# EAGLE design SparkFun_Artemis (EAGLE 9.4.0)
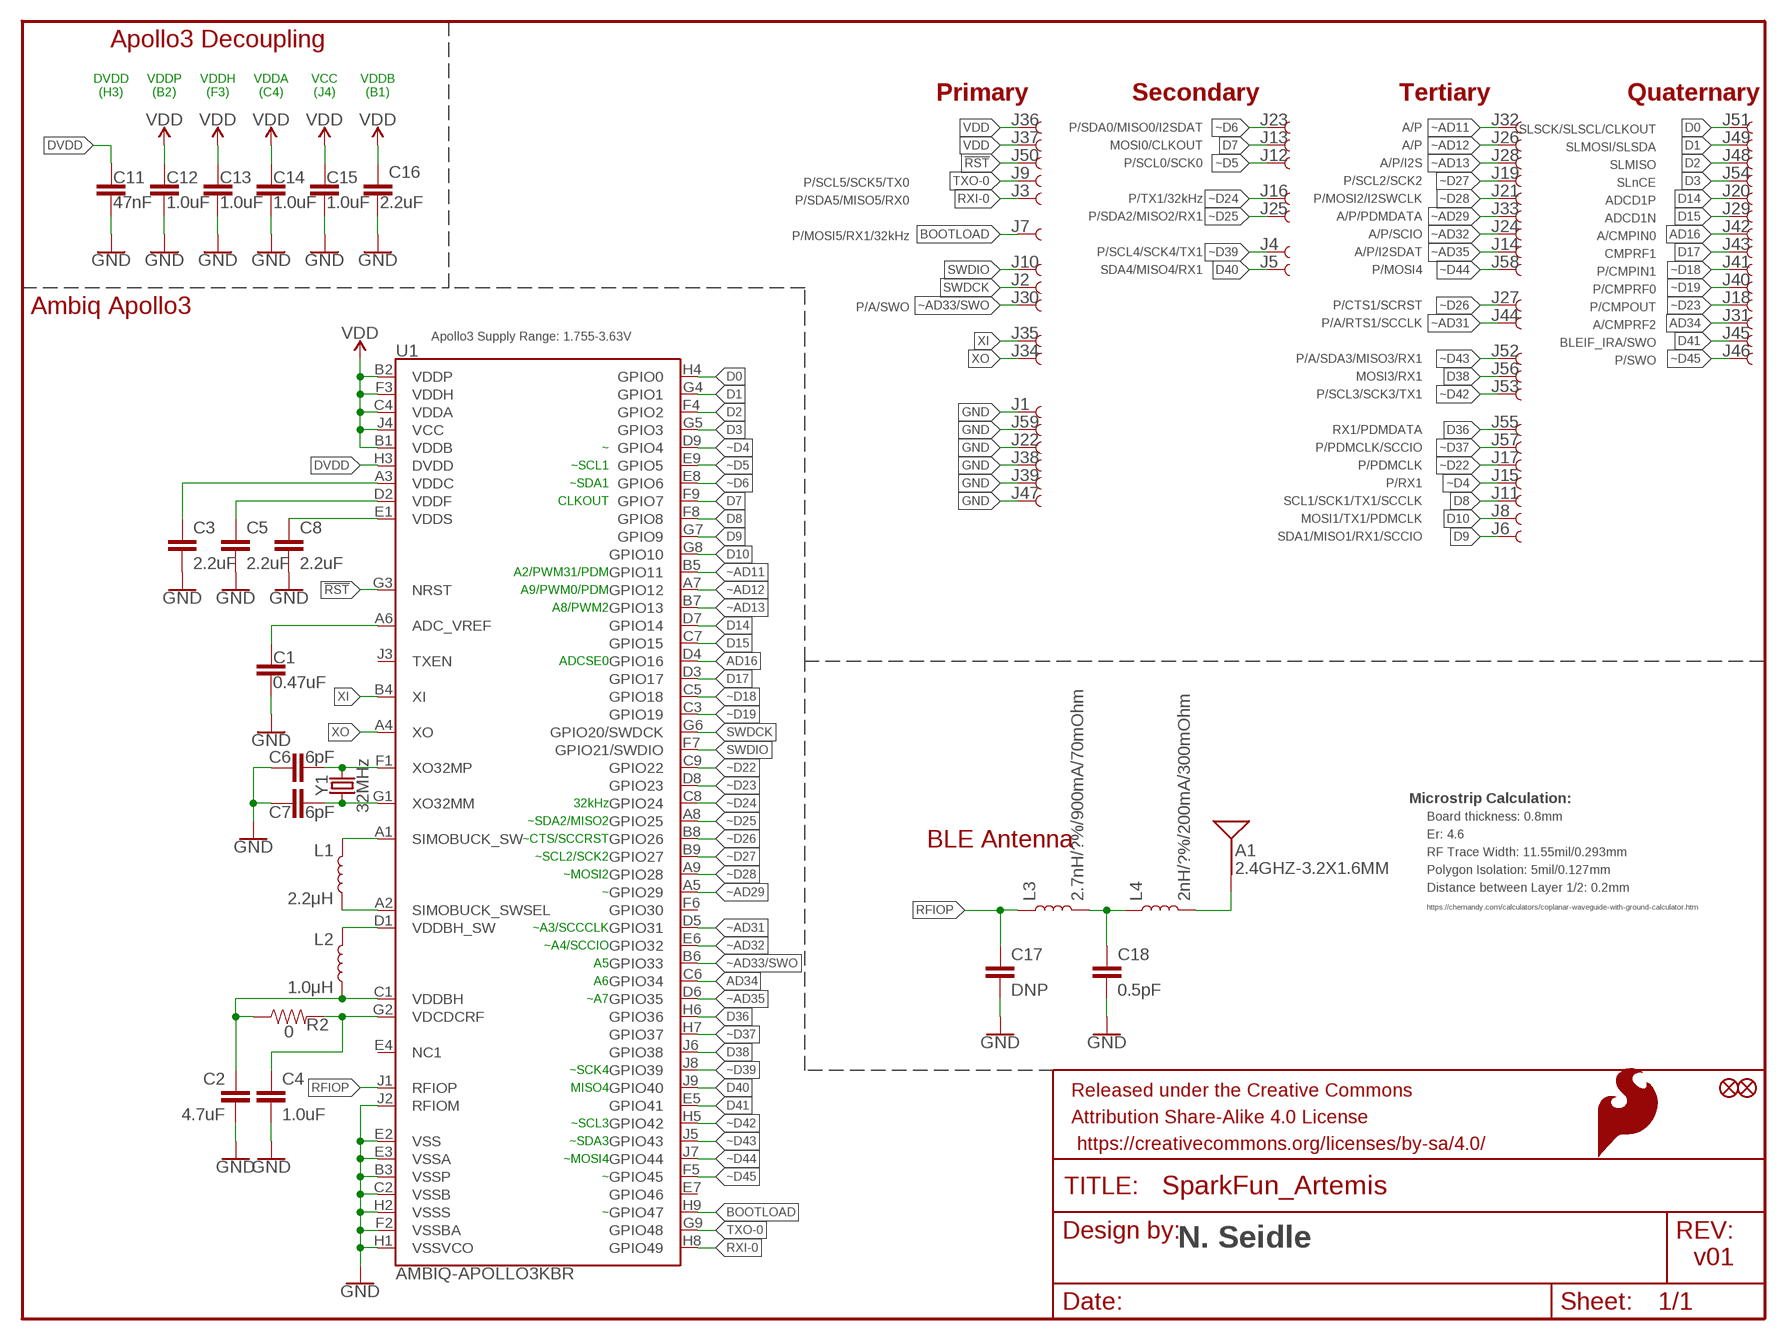
[diagram p0: schematic, sheet 1]

## Parts
A1  2.4GHZ-3.2X1.6MM  ANTENNA2.4GHZ-8.0X1.0MM  [ANT-2.4GHZ-8.0X1.0MM]
C1  0.47uF  470NF-0402_TIGHT-6.3V-10%-X5R  [0402-TIGHT]
C2  4.7uF  4.7UF-0402_TIGHT-6.3V-20%-X5R  [0402-TIGHT]
C3  2.2uF  2.2UF-0402_TIGHT-10V-10%-X5R  [0402-TIGHT]
C4  1.0uF  1.0UF-0402-TIGHT-16V-10%  [0402-TIGHT]
C5  2.2uF  2.2UF-0402_TIGHT-10V-10%-X5R  [0402-TIGHT]
C6  6pF  6PF-0402-TIGHT-50V-0.5%  [0402-TIGHT]
C7  6pF  6PF-0402-TIGHT-50V-0.5%  [0402-TIGHT]
C8  2.2uF  2.2UF-0402_TIGHT-10V-10%-X5R  [0402-TIGHT]
C11  47nF  47NF-0402_TIGHT-25V-10%-X7R  [0402-TIGHT]
C12  1.0uF  1.0UF-0402-TIGHT-16V-10%  [0402-TIGHT]
C13  1.0uF  1.0UF-0402-TIGHT-16V-10%  [0402-TIGHT]
C14  1.0uF  1.0UF-0402-TIGHT-16V-10%  [0402-TIGHT]
C15  1.0uF  1.0UF-0402-TIGHT-16V-10%  [0402-TIGHT]
C16  2.2uF  2.2UF-0402_TIGHT-10V-10%-X5R  [0402-TIGHT]
C17  DNP  DNP-CAP-0402-TIGHT  [0402-TIGHT]
C18  0.5pF  0.5PF-0402_TIGHT-20V-PM0.05PF-NP0  [0402-TIGHT]
FD3  FIDUCIAL0.2MM  [FIDUCIAL-0.2MM]
FD4  FIDUCIAL0.2MM  [FIDUCIAL-0.2MM]
FRAME1  FRAME-LETTER  [CREATIVE_COMMONS]
J1  PAD.4X.6  [MODULE_PAD]
J2  PAD.4X.6  [MODULE_PAD]
J3  PAD.4X.6  [MODULE_PAD]
J4  PAD.4X.6  [MODULE_PAD]
J5  PAD.4X.6  [MODULE_PAD]
J6  PAD.4X.6  [MODULE_PAD]
J7  PAD.4X.6  [MODULE_PAD]
J8  PAD.4X.6  [MODULE_PAD]
J9  PAD.4X.6  [MODULE_PAD]
J10  PAD.4X.6  [MODULE_PAD]
J11  PAD.4X.6  [MODULE_PAD]
J12  PAD.4X.6  [MODULE_PAD]
J13  PAD.4X.6  [MODULE_PAD]
J14  PAD.4X.6  [MODULE_PAD]
J15  PAD.4X.6  [MODULE_PAD]
J16  PAD.4X.6  [MODULE_PAD]
J17  PAD.4X.6  [MODULE_PAD]
J18  PAD.4X.6  [MODULE_PAD]
J19  PAD.4X.6  [MODULE_PAD]
J20  PAD.4X.6  [MODULE_PAD]
J21  PAD.4X.6  [MODULE_PAD]
J22  PAD.35X.35  [MODULE_MINI_PAD]
J23  PAD.4X.6  [MODULE_PAD]
J24  PAD.4X.6  [MODULE_PAD]
J25  PAD.4X.6  [MODULE_PAD]
J26  PAD.4X.6  [MODULE_PAD]
J27  PAD.4X.6  [MODULE_PAD]
J28  PAD.4X.6  [MODULE_PAD]
J29  PAD.4X.6  [MODULE_PAD]
J30  PAD.4X.6  [MODULE_PAD]
J31  PAD.4X.6  [MODULE_PAD]
J32  PAD.4X.6  [MODULE_PAD]
J33  PAD.4X.6  [MODULE_PAD]
J34  PAD.4X.6  [MODULE_PAD]
J35  PAD.4X.6  [MODULE_PAD]
J36  PAD.4X.6  [MODULE_PAD]
J37  PAD.4X.6  [MODULE_PAD]
J38  PAD.35X.35  [MODULE_MINI_PAD]
J39  PAD.4X.6  [MODULE_PAD]
J40  PAD.4X.6  [MODULE_PAD]
J41  PAD.4X.6  [MODULE_PAD]
J42  PAD.4X.6  [MODULE_PAD]
J43  PAD.4X.6  [MODULE_PAD]
J44  PAD.4X.6  [MODULE_PAD]
J45  PAD.4X.6  [MODULE_PAD]
J46  PAD.4X.6  [MODULE_PAD]
J47  PAD.4X.6  [MODULE_PAD]
J48  PAD.4X.6  [MODULE_PAD]
J49  PAD.4X.6  [MODULE_PAD]
J50  PAD.4X.6  [MODULE_PAD]
J51  PAD.4X.6  [MODULE_PAD]
J52  PAD.4X.6  [MODULE_PAD]
J53  PAD.4X.6  [MODULE_PAD]
J54  PAD.4X.6  [MODULE_PAD]
J55  PAD.4X.6  [MODULE_PAD]
J56  PAD.4X.6  [MODULE_PAD]
J57  PAD.4X.6  [MODULE_PAD]
J58  PAD.4X.6  [MODULE_PAD]
J59  PAD.4X.6  [MODULE_PAD]
L1  2.2μH  2.2μH-0805_WIDE-2.2μH-1.7A-0.14OHM  [0805-WIDE]
L2  1.0μH  1.0μH-0805_WIDE-1.0μH-1.45A-0.106OHM-1.0MM_H  [0805-WIDE]
L3  2.7nH/?%/900mA/70mOhm  INDUCTOR-0402_TIGHT-2.7NH  [0402-TIGHT]
L4  2nH/?%/200mA/300mOhm  INDUCTOR-0402_TIGHT-2.0NH  [0402-TIGHT]
LOGO1  SFE_LOGO_FLAME.05_INCH_INTERNAL  [SFE_LOGO_FLAME_INTERNAL_0.05]
R2  0  0OHM-0402T-1/10W  [0402-TIGHT]
U1  AMBIQ-APOLLO3KBR  [BGA-81-5X5MM]
Y1  32MHz  CRYSTAL-32MHZ-SMD-2.0X1.6MM  [CRYSTAL-SMD-2.0X1.6MM]

## Nets
!RST: J50.1 U1.G3(NRST)
AD16: J42.1 U1.D4(GPIO16)
AD34: J31.1 U1.C6(GPIO34)
ADC_VREF: C1.1 U1.A6(ADC_VREF)
BOOTLOAD: J7.1 U1.H9(GPIO47)
D0: J51.1 U1.H4(GPIO0)
D1: J49.1 U1.G4(GPIO1)
D2: J48.1 U1.F4(GPIO2)
D3: J54.1 U1.G5(GPIO3)
D7: J13.1 U1.F9(GPIO7)
D8: J11.1 U1.F8(GPIO8)
D9: J6.1 U1.G7(GPIO9)
D10: J8.1 U1.G8(GPIO10)
D14: J20.1 U1.D7(GPIO14)
D15: J29.1 U1.C7(GPIO15)
D17: J43.1 U1.D3(GPIO17)
D36: J55.1 U1.H6(GPIO36)
D38: J56.1 U1.J6(GPIO38)
D40: J5.1 U1.J9(GPIO40)
D41: J45.1 U1.E5(GPIO41)
DVDD: C11.1 U1.H3(DVDD)
GND: C1.2 C2.2 C3.2 C4.2 C5.2 C6.1 C7.1 C8.2 C11.2 C12.2 C13.2 C14.2 C15.2 C16.2 C17.2 C18.2 J1.1 J22.1 J38.1 J39.1 J47.1 J59.1 U1.B3(VSSP) U1.C2(VSSB) U1.E2(VSS) U1.E3(VSSA) U1.F2(VSSBA) U1.H1(VSSVCO) U1.H2(VSSS) U1.J2(RFIOM)
N$1: A1.FEED(SIGNAL) L4.2
N$2: C7.2 U1.G1(XO32MM) Y1.1
N$3: C6.2 U1.F1(XO32MP) Y1.3
N$16: C18.1 L3.2 L4.1
RFIOP: C17.1 L3.1 U1.J1(RFIOP)
RXI-0: J3.1 U1.H8(GPIO49)
SIMBUCK_SWSEL: L1.2 U1.A2(SIMOBUCK_SWSEL)
SIMOBUCK_SW: L1.1 U1.A1(SIMOBUCK_SW)
SWDCK: J2.1 U1.G6(GPIO20/SWDCK)
SWDIO: J10.1 U1.F7(GPIO21/SWDIO)
TXO-0: J9.1 U1.G9(GPIO48)
VDCDCRF: C4.1 R2.2 U1.G2(VDCDCRF)
VDD: C12.1 C13.1 C14.1 C15.1 C16.1 J36.1 J37.1 U1.B1(VDDB) U1.B2(VDDP) U1.C4(VDDA) U1.F3(VDDH) U1.J4(VCC)
VDDBH: C2.1 L2.2 R2.1 U1.C1(VDDBH)
VDDBH_SW: L2.1 U1.D1(VDDBH_SW)
VDDC: C3.1 U1.A3(VDDC)
VDDF: C5.1 U1.D2(VDDF)
VDDS: C8.1 U1.E1(VDDS)
XI: J35.1 U1.B4(XI)
XO: J34.1 U1.A4(XO)
~AD11: J32.1 U1.B5(GPIO11)
~AD12: J26.1 U1.A7(GPIO12)
~AD13: J28.1 U1.B7(GPIO13)
~AD29: J33.1 U1.A5(GPIO29)
~AD31: J44.1 U1.D5(GPIO31)
~AD32: J24.1 U1.E6(GPIO32)
~AD33/SWO: J30.1 U1.B6(GPIO33)
~AD35: J14.1 U1.D6(GPIO35)
~D4: J15.1 U1.D9(GPIO4)
~D5: J12.1 U1.E9(GPIO5)
~D6: J23.1 U1.E8(GPIO6)
~D18: J41.1 U1.C5(GPIO18)
~D19: J40.1 U1.C3(GPIO19)
~D22: J17.1 U1.C9(GPIO22)
~D23: J18.1 U1.D8(GPIO23)
~D24: J16.1 U1.C8(GPIO24)
~D25: J25.1 U1.A8(GPIO25)
~D26: J27.1 U1.B8(GPIO26)
~D27: J19.1 U1.B9(GPIO27)
~D28: J21.1 U1.A9(GPIO28)
~D37: J57.1 U1.H7(GPIO37)
~D39: J4.1 U1.J8(GPIO39)
~D42: J53.1 U1.H5(GPIO42)
~D43: J52.1 U1.J5(GPIO43)
~D44: J58.1 U1.J7(GPIO44)
~D45: J46.1 U1.F5(GPIO45)
Unconnected: U1.E4(NC1) U1.E7(GPIO46) U1.F6(GPIO30) U1.J3(TXEN)

## Notes on the sheet
- Apollo3 Decoupling
- DVDD
  (H3)
- VDDP
  (B2)
- VDDH
  (F3)
- VDDA
  (C4)
- VCC
  (J4)
- VDDB
  (B1)
- Primary | Secondary | Tertiary | Quaternary
- P/SDA0/MISO0/I2SDAT | A/P | SLSCK/SLSCL/CLKOUT
- MOSI0/CLKOUT | A/P | SLMOSI/SLSDA
- P/SCL0/SCK0 | A/P/I2S | SLMISO
- P/SCL5/SCK5/TX0 | P/SCL2/SCK2 | SLnCE
- P/SDA5/MISO5/RX0 | P/TX1/32kHz | P/MOSI2/I2SWCLK | ADCD1P
- P/SDA2/MISO2/RX1 | A/P/PDMDATA | ADCD1N
- P/MOSI5/RX1/32kHz | A/P/SCIO | A/CMPIN0
- P/SCL4/SCK4/TX1 | A/P/I2SDAT | CMPRF1
- SDA4/MISO4/RX1 | P/MOSI4 | P/CMPIN1
- P/CMPRF0
- Ambiq Apollo3 | P/A/SWO | P/CTS1/SCRST | P/CMPOUT
- P/A/RTS1/SCCLK | A/CMPRF2
- Apollo3 Supply Range: 1.755-3.63V | BLEIF_IRA/SWO
- P/A/SDA3/MISO3/RX1 | P/SWO
- MOSI3/RX1
- P/SCL3/SCK3/TX1
- RX1/PDMDATA
- ~ | P/PDMCLK/SCCIO
- ~SCL1 | P/PDMCLK
- ~SDA1 | P/RX1
- CLKOUT | SCL1/SCK1/TX1/SCCLK
- MOSI1/TX1/PDMCLK
- SDA1/MISO1/RX1/SCCIO
- A2/PWM31/PDM
- A9/PWM0/PDM
- A8/PWM2
- ADCSE0
- 32kHz | Microstrip Calculation:
- ~SDA2/MISO2 | Board thickness: 0.8mm
- ~CTS/SCCRST | BLE Antenna | Er: 4.6
- ~SCL2/SCK2 | RF Trace Width: 11.55mil/0.293mm
- ~MOSI2 | Polygon Isolation: 5mil/0.127mm
- ~ | Distance between Layer 1/2: 0.2mm
- https://chemandy.com/calculators/coplanar-waveguide-with-ground-calculator.htm
- ~A3/SCCCLK
- ~A4/SCCIO
- A5
- A6
- ~A7
- ~SCK4
- MISO4
- ~SCL3
- ~SDA3
- ~MOSI4
- ~
- ~
- N. Seidle | v01

## Library data of the parts
A1 = SparkFun-RF:ANTENNA: Single-ended Antennae 2.4GHz and antennae with just one terminal. These are all chip antennae. 2.4GHz (WiFi/BT/ZigBee) Antennae ANT-2.4GHZ-6.5X2.2MM - 6.5 x 2.2 mm chip antenna. (SparkFun Product <https://www.sparkfun.com/products/144>) ANT-2.4GHZ8.0X1.0MM - 8.0 x 1.0 mm chip antenna. (Datasheet <http://www.mouser.com/ds/2/611/antenna_2500at44m0400-242425.pdf>) ANT-2.4GHZ9.5X2.0MM - 9.5 x 2.0 mm chip antenna. (SparkFun Product <https://www.sparkfun.com/products/9025>); PROD_ID: ANT-14377
C1 = SparkFun-Capacitors:470NF: 0.47uF/470nF ceramic capacitors A capacitor is a passive two-terminal electrical component used to store electrical energy temporarily in an electric field.; PROD_ID: CAP-14242
C2 = SparkFun-Capacitors:4.7UF: 4.7µF ceramic capacitors A capacitor is a passive two-terminal electrical component used to store electrical energy temporarily in an electric field.; PROD_ID: CAP-14240
C3 C5 C8 C16 = SparkFun-Capacitors:2.2UF: 2.2µF ceramic capacitors A capacitor is a passive two-terminal electrical component used to store electrical energy temporarily in an electric field.; PROD_ID: CAP-14232
C4 C12-C15 = ambiq:1.0UF: 1µF ceramic capacitors A capacitor is a passive two-terminal electrical component used to store electrical energy temporarily in an electric field.; PROD_ID: CAP-12417
C6 C7 = ambiq:6PF: 6pF ceramic capacitors A capacitor is a passive two-terminal electrical component used to store electrical energy temporarily in an electric field.; PROD_ID: CAP-13455
C11 = SparkFun-Capacitors:47NF: 47nF ceramic capacitors A capacitor is a passive two-terminal electrical component used to store electrical energy temporarily in an electric field.; PROD_ID: CAP-14243
C17 = ambiq:DNP-CAP: 0.18µF ceramic capacitor A capacitor is a passive two-terminal electrical component used to store electrical energy temporarily in an electric field.
C18 = SparkFun-Capacitors:0.5PF: 0.5pF ceramic capacitors A capacitor is a passive two-terminal electrical component used to store electrical energy temporarily in an electric field.; PROD_ID: CAP-14231
FD3 FD4 = SparkFun-Aesthetics:FIDUCIAL: Fiducial Alignment Points Point-of-reference for pick-and-place machines and other optical instruments.
FRAME1 = SparkFun-Aesthetics:FRAME-LETTER: Schematic Frame - Letter Standard 8.5x11 US Letter frame
J1-J59 = Module-Pads:PAD
L1 = SparkFun-Coils:2.2μH: 2.2μH Inductor Resist changes in electrical current. Basically a coil of wire. SparkFun Products: SparkFun Edge - HX711 <https://www.sparkfun.com/products/15170>; PROD_ID: NDUC-14234
L2 = SparkFun-Coils:1.0μH: 1.0μH Inductor Resist changes in electrical current. Basically a coil of wire. SparkFun Products: SparkFun Edge <https://www.sparkfun.com/products/15170>; PROD_ID: NDUC-14375
L3 = SparkFun-Coils:INDUCTOR: Inductors Resist changes in electrical current. Basically a coil of wire. SparkFun Products: SparkFun Load Cell Amplifier - HX711 <https://www.sparkfun.com/products/13879> IOIO-OTG - V2.2 <https://www.sparkfun.com/products/13613>; PROD_ID: NDUC-14236
L4 = SparkFun-Coils:INDUCTOR: Inductors Resist changes in electrical current. Basically a coil of wire. SparkFun Products: SparkFun Load Cell Amplifier - HX711 <https://www.sparkfun.com/products/13879> IOIO-OTG - V2.2 <https://www.sparkfun.com/products/13613>; PROD_ID: NDUC-14238
LOGO1 = SparkFun-Aesthetics:SFE_LOGO_FLAME: SparkFun Flame Logo This is the SparkFun flame logo. The logo on the schematic will always be the same size; the package variant is the height of the flame. Default layer for the logo on the board is tSilk.
R2 = SparkFun-Resistors:0OHM: 0Ω resistor A resistor is a passive two-terminal electrical component that implements electrical resistance as a circuit element. Resistors act to reduce current flow, and, at the same time, act to lower voltage levels within circuits. - Wikipedia; PROD_ID: RES-14244
U1 = SparkFun-IC-Microcontroller:AMBIQ-APOLLO3; PROD_ID: IC-14228
Y1 = SparkFun-Clocks:CRYSTAL-32MHZ: 32MHz Crystal Digikey Example <http://www.digikey.com/product-detail/en/murata-electronics-north-america/XRCGB32M000F2P00R0/490-9769-1-ND/4952013> Frequency: 32MHz Frequency Stability: ±20ppm Frequency Tolerance: ±20ppm Load Capacitance: 6pF SparkFun Products SparkFun nRF52832 Breakout <https://www.sparkfun.com/products/13990>; PROD_ID: XTAL-13459

## Net classes
1 power: width 0.178 mm
2 3.3V: width 0.508 mm

## Board
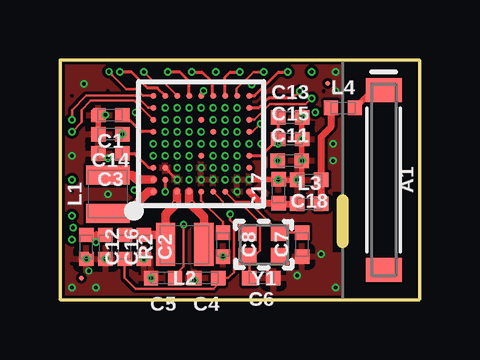
[diagram p1: board, top side]
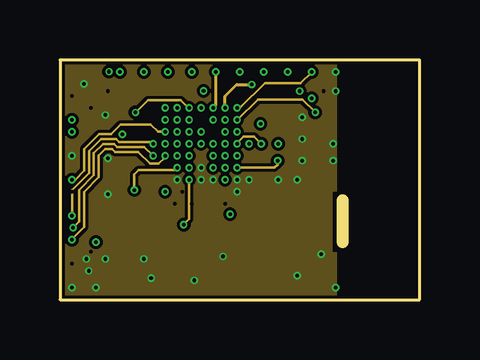
[diagram p2: board, inner layer GND]
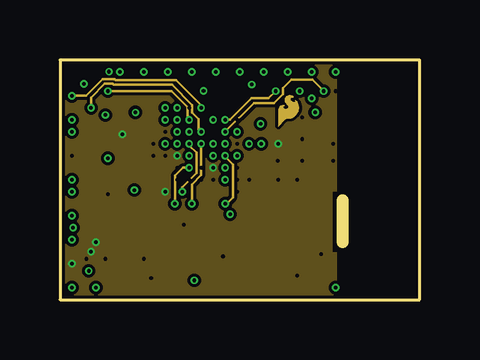
[diagram p3: board, inner layer VDD]
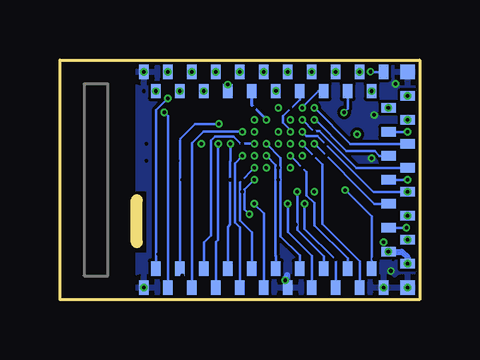
[diagram p4: board, bottom side, seen from below]

Size 15 x 10 mm. Coordinates in mm from the lower left corner, seen from the top.
Outline: 0,0 15,0 15,10 0,10 0,0
Copper layers ((1*2)+(15*16)): Top 0.035mm / dielectric 0.213359375mm / GND 0.035mm / dielectric 1.0161mm / VDD 0.035mm / dielectric 0.213359375mm / Bottom 0.035mm
Design rules "SparkFun-4-layer-BGA-Extreme *": minimum track width 4mil, minimum drill 0.15mm, track to track 4mil, track to pad 4mil, pad to pad 4mil, via to via 4mil, smd to smd 0mil, copper to edge 5mil, drill to drill 4mil, minimum pad ring 3mil, minimum via ring 3mil, stop-mask expansion 4mil, vias tented up to drill 25mil, thermal gap 10mil
Milling: 1 lines

### Footprints (pad centres in the part's own frame; a part is rotated, then mirrored left to right if it is on the bottom)
ANT-2.4GHZ-8.0X1.0MM = smd 1 x 1.5: FEED -3.75,0; NC 3.75,0
0402-TIGHT = smd 0.6 x 0.6: 1 -0.5,0; 2 0.5,0
FIDUCIAL-0.2MM = smd 0.2 x 0.2: 1 0,0
MODULE_PAD = smd 0.6 x 0.4: 1 0,0
MODULE_MINI_PAD = smd 0.6 x 0.6: 1 0,0
0805-WIDE = smd 0.8 x 1.8: 1 -0.8,0; 2 0.8,0
BGA-81-5X5MM = smd 0.254 x 0.254: A1 -2,2; A2 -1.5,2; A3 -1,2; A4 -0.5,2; A5 0,2; A6 0.5,2; A7 1,2; A8 1.5,2; A9 2,2; B1 -2,1.5; B2 -1.5,1.5; B3 -1,1.5; B4 -0.5,1.5; B5 0,1.5; B6 0.5,1.5; B7 1,1.5; B8 1.5,1.5; B9 2,1.5; C1 -2,1; C2 -1.5,1; C3 -1,1; C4 -0.5,1; C5 0,1; C6 0.5,1; C7 1,1; C8 1.5,1; C9 2,1; D1 -2,0.5; D2 -1.5,0.5; D3 -1,0.5; D4 -0.5,0.5; D5 0,0.5; D6 0.5,0.5; D7 1,0.5; D8 1.5,0.5; D9 2,0.5; E1 -2,0; E2 -1.5,0; E3 -1,0; E4 -0.5,0; E5 0,0; E6 0.5,0; E7 1,0; E8 1.5,0; E9 2,0; F1 -2,-0.5; F2 -1.5,-0.5; F3 -1,-0.5; F4 -0.5,-0.5; F5 0,-0.5; F6 0.5,-0.5; F7 1,-0.5; F8 1.5,-0.5; F9 2,-0.5; G1 -2,-1; G2 -1.5,-1; G3 -1,-1; G4 -0.5,-1; G5 0,-1; G6 0.5,-1; G7 1,-1; G8 1.5,-1; G9 2,-1; H1 -2,-1.5; H2 -1.5,-1.5; H3 -1,-1.5; H4 -0.5,-1.5; H5 0,-1.5; H6 0.5,-1.5; H7 1,-1.5; H8 1.5,-1.5; H9 2,-1.5; J1 -2,-2; J2 -1.5,-2; J3 -1,-2; J4 -0.5,-2; J5 0,-2; J6 0.5,-2; J7 1,-2; J8 1.5,-2; J9 2,-2
CRYSTAL-SMD-2.0X1.6MM = smd 0.75 x 0.7: 1 -0.675,-0.5; 2 0.675,-0.5; 3 0.675,0.5; 4 -0.675,0.5

### Placement (x,y rotation side)
A1  13.5,5 270 top
C1  2.1,7.7 180 top
C2  3.5,2.2 270 top
C3  2.1,6.1 180 top
C4  6.1,0.9 180 top
C5  4.3,0.9 180 top
C6  8.4,0.9 180 top
C7  10.1,2.3 90 top
C8  6.8,2.3 270 top
C11  9.59,5.8 0 top
C12  1.1,2.2 270 top
C13  9.6,7.6 0 top
C14  2.1,6.9 180 top
C15  9.6,6.7 0 top
C16  1.9,2.2 270 top
C17  9.12,4.52 90 top
C18  10.4,5 180 top
FD3  0.89,0.89 0 top
FD4  11.18,9.02 0 top
FRAME1  1,-13 0 top  (outside the outline)
J1  11.5,9.5 270 bottom
J2  11,8.7 270 bottom
J3  10.5,9.5 90 bottom
J4  10,8.7 270 bottom
J5  9.5,9.5 270 bottom
J6  9,8.7 270 bottom
J7  8.5,9.5 270 bottom
J8  8,8.7 270 bottom
J9  7.5,9.5 90 bottom
J10  7,8.7 90 bottom
J11  6.5,9.5 270 bottom
J12  6,8.7 270 bottom
J13  5.5,9.5 270 bottom
J14  5,8.7 90 bottom
J15  4.5,9.5 270 bottom
J16  4,8.7 90 bottom
J17  3.5,9.5 270 bottom
J18  3,8.7 90 bottom
J19  2.5,9.5 90 bottom
J20  2,8.7 90 bottom
J21  1.5,9.5 90 bottom
J22  0.5,9.5 90 bottom
J23  0.5,8.5 180 bottom
J24  1.3,8 0 bottom
J25  0.5,7.5 0 bottom
J26  1.3,7 180 bottom
J27  0.5,6.5 0 bottom
J28  1.3,6 180 bottom
J29  0.5,5.5 0 bottom
J30  1.3,5 180 bottom
J31  0.5,4.5 180 bottom
J32  1.3,4 0 bottom
J33  0.5,3.5 180 bottom
J34  1.3,3 0 bottom
J35  0.5,2.5 0 bottom
J36  1.3,2 180 bottom
J37  0.5,1.5 0 bottom
J38  0.5,0.5 0 bottom
J39  1.5,0.5 90 bottom
J40  2,1.3 270 bottom
J41  2.5,0.5 270 bottom
J42  3,1.3 270 bottom
J43  3.5,0.5 270 bottom
J44  4,1.3 90 bottom
J45  4.5,0.5 270 bottom
J46  5,1.3 270 bottom
J47  5.5,0.5 270 bottom
J48  6,1.3 270 bottom
J49  6.5,0.5 270 bottom
J50  7,1.3 90 bottom
J51  7.5,0.5 270 bottom
J52  8,1.3 90 bottom
J53  8.5,0.5 90 bottom
J54  9,1.3 270 bottom
J55  9.5,0.5 90 bottom
J56  10,1.3 270 bottom
J57  10.5,0.5 270 bottom
J58  11,1.3 270 bottom
J59  11.5,0.5 270 bottom
L1  2,4.4 90 top
L2  5.2,2.3 180 top
L3  10.4,4 0 top
L4  11.8,8 0 top
LOGO1  9.53,7.87 0 top
R2  2.7,2.2 270 top
U1  5.89,6.5 90 top
Y1  8.5,2.3 180 top

### Tracks (layer width: path | path; a pad name or v marks a point on that pad's centre or on a via)
!RST  (via drill 0.15)
  Bottom 0.102: J50.1 7,2.8 7.5,3.3 7.5,4.89 U1.G3
  other vias: 6.89,5.5
AD16  (via drill 0.15)
  Bottom 0.102: U1.D4 4.72,5.33 4.72,4.35 4.39,4.03 4.39,3.1 3,1.71 J42.1
  other vias: 5.39,6
AD34  (via drill 0.15, 0.15 layers 15-16)
  Bottom 0.102: U1.C6 4.72,6.83 4.25,6.83 1.92,4.5 J31.1
  other vias: 4.89,7 0.5,4.5
ADC_VREF
  Top 0.127: U1.A6 3.39,7 2.69,7.7 C1.1
BOOTLOAD  (via drill 0.15)
  Top 0.102: U1.H9 7.37,8.52 7.37,8.81 8.06,9.5 J7.1
  other vias: 8.5,9.5
D0  (via drill 0.15)
  Bottom 0.102: J51.1 7.5,3.01 7.7,3.22 7.7,5.69 U1.H4
  other vias: 7.39,6
D1  (via drill 0.15, 0.15 layers 15-16)
  VDD 0.102: U1.G4 6.89,5.97 7.22,5.64 7.22,4.26 6.95,4 v6.9,4
  Bottom 0.102: J49.1 6.5,3.6 v6.9,4
  other vias: 6.89,6
D2  (via drill 0.15)
  Bottom 0.102: J48.1 6,1.81 6.01,1.82 6.01,5.62 U1.F4
  other vias: 6.39,6
D3  (via drill 0.15)
  Bottom 0.102: J54.1 9,2.39 8.7,2.69 8.7,6.63 8.53,6.8 7.76,6.8 7.46,6.5 U1.G5
  other vias: 6.89,6.5
D7  (via drill 0.15)
  Top 0.127: U1.F9 6.36,8.53 6.36,9.06 5.92,9.5 J13.1
  other vias: 5.5,9.5
D8  (via drill 0.15, 0.15 layers 1-2)
  GND 0.127: U1.F8 6.5,8.11 J11.1
  other vias: 6.39,8 6.5,9.5
D9  (via drill 0.15, 0.15 layers 15-16)
  Top 0.102: U1.G7
  VDD 0.102: J6.1 8.7,8.4 8,8.4 7.1,7.5 U1.G7
  other vias: 6.89,7.5 9,8.7
D10  (via drill 0.15, 0.15 layers 1-2)
  GND 0.127: U1.G8 6.89,8.49 7.37,8.97 v8,8.97
  Bottom 0.127: v8,8.97 J8.1
  other vias: 6.89,8
D14  (via drill 0.15, 0.15 layers 15-16)
  VDD 0.102: U1.D7 5.32,7.57 5.32,8.04 4.65,8.7 J20.1
  other vias: 5.39,7.5 2,8.7
D15  (via drill 0.15)
  Bottom 0.102: U1.C7 4.42,7.03 4.17,7.03 2.63,5.5 J29.1
  other vias: 4.89,7.5
D17  (via drill 0.15, 0.15 layers 15-16)
  VDD 0.102: U1.D3 5.13,5.5 4.79,5.17 v4.79,4
  Bottom 0.102: v4.79,4 4.79,2.95 3.5,1.66 J43.1
  other vias: 5.39,5.5
D36  (via drill 0.15)
  Bottom 0.102: U1.H6 7.4,7.01 9.02,7.01 9.5,6.53 J55.1
  other vias: 7.39,7
D38  (via drill 0.15)
  Top 0.102: U1.J6 8.04,7 v8.37,7.33
  Bottom 0.102: J56.1 10,6.7 9.37,7.33 v8.37,7.33
D40  (via drill 0.15)
  Top 0.127: J5.1 9.12,9.5 8.12,8.5 U1.J9
  other vias: 9.5,9.5
D41  (via drill 0.15, 0.15 layers 15-16)
  VDD 0.102: U1.E5 5.89,6.22 5.89,6.21 5.89,5.2 5.5,4.8 v5.5,4
  Bottom 0.102: v5.5,4 5.5,2.82 4.5,1.82 J45.1
  other vias: 5.89,6.5
DVDD  (via drill 0.15 layers 1-2)
  Top 0.127: C11.1 9.09,5.99
  GND 0.102: U1.H3 8.95,5.5 9.09,5.64 C11.1
  GND 0.127: C11.1
  other vias: 7.39,5.5 9.09,5.8
GND  (via drill 0.15, 0.15 layers 1-2)
  Top 0.127: U1.B3 4.52,5.37 4.52,5.35 4.74,5.13 4.75,5.13 U1.C2
  Top 0.2: C1.2 C14.2 | U1.J2 v9.1,5 C17.2 9.14,5 C18.2 10.09,5.19 C11.2 10.09,6.69 C15.2 C13.2
  Bottom 0.254: J47.1 5.5,0.7 v5.6,0.8 5.6,0.88 5.53,0.95 5.53,1.03
  other vias: 4.89,5 6.39,5 5.89,5 7.39,5 7.89,5 7.39,4.5 5.89,5.5 3.5,1.7 1.9,1.7 1.1,1.7 6.8,1.8 10.1,7.6 9.9,5 11.5,8.7 11.4,6.5 11.4,5.8 11.5,9.5 10.9,1.9 9.9,1 1.5,0.5 11.5,0.5 10.1,6.7 10.1,5.8 1,9 2,5.9 0.5,6 1.9,7.7 0.5,0.5 1.2,1.2 2,4.4 3.8,0.9
  pour GND (isolate 0.127, rank 6): 0,10 0,0 11.5,0 11.5,10
  pour Bottom (isolate 0.127): 0,10 0,0 11.8,0 11.8,10
  pour Top (isolate 0.127): 11.81,10 11.81,0 0,0 0,10
N$1
  Top 0.254: A1.FEED 13.05,8.75 L4.2
N$2
  Top 0.102: U1.G1 7.32,4.07 7.89,4.07 9.17,2.8 Y1.1 | 9.12,2.74 9.24,2.74 Y1.1 | Y1.1 C7.2
  Top 0.127: 9.38,2.6 9.24,2.74
N$3
  Top 0.102: U1.F1 7.02,3.87 7.7,3.87 8.35,3.21 8.35,2.05 8.1,1.8 Y1.3 | Y1.3 | Y1.3 7.9,1.73 C6.2 | Y1.3 | Y1.3 7.83,1.86
  Top 0.127: U1.F1
N$4
  cutout GND (isolate 0.305): 11.4,4.5 12.1,4.5 12.1,2 11.4,2
  cutout VDD (isolate 0.305): 11.4,4.5 12.1,4.5 12.1,2 11.4,2
  cutout Top (isolate 0.305): 11.4,4.5 12.1,4.5 12.1,2 11.4,2
  cutout Bottom (isolate 0.305): 11.4,4.5 12.1,4.5 12.1,2 11.4,2
N$16
  Top 0.293: L3.2 C18.1 10.9,6.8 11.3,7.2 L4.1
RFIOP
  Top 0.293: U1.J1 8.37,4.02 C17.1 | 9.14,4 L3.1
  Top 0.305: C17.1 9.14,4
RXI-0  (via drill 0.15, 0.15 layers 1-2)
  GND 0.102: J3.1 10.03,9.03 8.55,9.03 7.52,8 U1.H8
  other vias: 7.39,8 10.5,9.5
SIMBUCK_SWSEL
  Top 0.356: 2.54,5 2.34,5.2 L1.2 3,5.2 3.2,5 U1.A2
SIMOBUCK_SW
  Top 0.356: L1.1 2.81,3.6 3.71,4.5 U1.A1
SWDCK  (via drill 0.15, 0.15 layers 15-16)
  VDD 0.102: J2.1 10.53,9.17 9.65,9.17 9.3,8.83 9.3,8.57 8.93,8.2 8.08,8.2 U1.G6
  other vias: 6.89,7 11,8.7
SWDIO  (via drill 0.15)
  Bottom 0.127: U1.F7 7,8.11 J10.1
  other vias: 6.39,7.5
TXO-0  (via drill 0.15)
  Top 0.127: U1.G9 6.89,9.29 7.1,9.5 J9.1
  other vias: 7.5,9.5
VDCDCRF  (via drill 0.15)
  Top 0.102: v7.1,3.57 7.1,3.32 7.25,3.16 7.25,1.14 7.02,0.9 C4.1 6.6,0.65 6.4,0.45 3.15,0.45 2.7,0.9 R2.2
  Bottom 0.102: v7.1,3.57 7.3,3.77 7.3,4.59 U1.G2
  other vias: 6.89,5
VDD  (via drill 0.15, 0.15 layers 15-16)
  Top 0.102: C15.1 v9.1,6.5
  Top 0.127: U1.B2 U1.B1 | U1.J4 8.4,6 C15.1 C13.1 | C16.1 1.7,2.5
  Top 0.2: C16.1 2,2.6
  Top 0.254: v1.5,2.4 1.5,2.67 1.52,2.7
  Top 0.3: C12.1 1.52,2.7 C16.1
  Bottom 0.254: J36.1 0.75,2 0.5,1.75 J37.1
  other vias: 4.39,4.5 6.39,5.5 4.89,6 2.6,6.9 0.5,1.5 1.3,2
  pour VDD (isolate 0.127): 0,10 0,0 11.5,0 11.5,10
VDDBH
  Top 0.356: U1.C1 4.89,4.03 4.4,3.55 4.4,2.67 | 4.4,2.19 L2.2 4.4,2.67 | 4.4,2.67 4.37,2.7 C2.1 R2.1
VDDBH_SW
  Top 0.356: U1.D1 5.39,4.06 6,3.45 L2.1
VDDC
  Top 0.127: U1.A3 3.7,5.5 3.1,6.1 C3.1
VDDF  (via drill 0.15 layers 1-2)
  Top 0.102: C5.1 4.8,1.02 5.16,1.38 v5.16,3.13
  GND 0.102: U1.D2 5.39,3.36 v5.16,3.13
  other vias: 5.39,5
VDDS
  Top 0.102: U1.E1 5.89,4.14 6.8,3.23 C8.1
XI  (via drill 0.15, 0.15 layers 1-2)
  GND 0.102: U1.B4 4.39,5.94 4.12,5.67 3.75,5.67 3.26,6.17 2.3,6.17 2.18,6.28 1.88,6.28 1.62,6.02 1.62,5.11 1,4.5 1,3.71 1.01,3.71 1.01,3.03 0.5,2.52 J35.1
  other vias: 4.39,6 0.5,2.5
XO  (via drill 0.15, 0.15 layers 1-2)
  GND 0.102: v0.55,3 0.8,3.26 0.8,3.63 0.8,4.58 1.41,5.2 1.41,6.11 1.8,6.5 2.25,6.5 2.38,6.37 3.52,6.37 U1.A4
  Bottom 0.102: J34.1 v0.55,3
  other vias: 3.89,6
~AD11  (via drill 0.15)
  Bottom 0.102: U1.B5 1.89,4 J32.1
  other vias: 4.39,6.5
~AD12  (via drill 0.15)
  Top 0.102: U1.A7 3.09,8.3 1.28,8.3 0.9,7.92 0.9,7.4 v0.5,7
  Bottom 0.102: v0.5,7 J26.1
~AD13  (via drill 0.15)
  Bottom 0.102: U1.B7 4.35,7.5 3.05,6.2 1.87,6.2 1.67,6 J28.1
  other vias: 4.39,7.5
~AD29  (via drill 0.15, 0.15 layers 1-2)
  GND 0.102: J33.1 0.5,4.57 1.21,5.28 1.21,6.2 1.71,6.7 2.33,6.7 2.46,6.57 3.82,6.57 U1.A5
  other vias: 3.89,6.5 0.5,3.5
~AD31  (via drill 0.15, 0.15 layers 15-16)
  VDD 0.102: v5.1,4.5 5.1,4.69 5.69,5.28 5.69,6.13 5.39,6.43 U1.D5
  Bottom 0.102: v5.1,4.5 5.1,2.9 4,1.8 J44.1
  other vias: 5.39,6.5
~AD32  (via drill 0.15, 0.15 layers 15-16)
  VDD 0.102: U1.E6 5.79,7.1 5.79,7.53 5.52,7.8 5.52,8.12 4.68,8.96 2.24,8.96 2.2,9 1.87,9 1.3,8.43 J24.1
  other vias: 5.89,7 1.3,8
~AD33/SWO  (via drill 0.15, 0.15 layers 1-2)
  GND 0.102: v0.5,5 0.63,5 1.01,5.38 1.01,6.28 1.63,6.9 2.14,6.9 2.53,7.3 3.79,7.3 4.09,7 U1.B6
  Bottom 0.102: v0.5,5 J30.1
  other vias: 4.39,7
~AD35  (via drill 0.15)
  Bottom 0.102: U1.D6 5.39,7.07 5.69,7.38 5.69,7.66 5,8.35 J14.1
  other vias: 5.39,7
~D4  (via drill 0.15)
  Top 0.127: U1.D9 5.39,9.11 5,9.5 J15.1
  other vias: 4.5,9.5
~D5  (via drill 0.15)
  Top 0.127: U1.E9 5.89,8.61 v5.99,8.71
  Bottom 0.127: J12.1 v5.99,8.71
~D6  (via drill 0.15, 0.15 layers 15-16)
  VDD 0.102: J23.1 1.09,8.51 1.79,9.21 2.28,9.21 2.32,9.16 4.83,9.16 5.89,8.11 U1.E8
  other vias: 0.5,8.5 5.89,8
~D18  (via drill 0.15)
  Bottom 0.102: U1.C5 4.89,6.47 4.06,5.64 4.06,3.16 2.5,1.6 J41.1
  other vias: 4.89,6.5
~D19  (via drill 0.15, 0.15 layers 1-2)
  Top 0.127: U1.C3
  GND 0.102: U1.C3 4.79,5.4 3.29,5.4 3.1,5.21 v3.1,4.57
  Bottom 0.102: J40.1 2,3.47 v3.1,4.57
  other vias: 4.89,5.5
~D22  (via drill 0.15)
  Top 0.102: U1.C9 4.26,9.13 3.87,9.13 J17.1
  other vias: 3.5,9.5
~D23  (via drill 0.15, 0.15 layers 1-2)
  GND 0.102: U1.D8 5.35,8 5.02,8.33 3.68,8.33 v3.15,7.81
  Bottom 0.102: v3.15,7.81 3,7.96 J18.1
  other vias: 5.39,8
~D24  (via drill 0.15)
  Bottom 0.102: U1.C8 4.89,8.03 4.22,8.7 J16.1
  other vias: 4.89,8
~D25  (via drill 0.15)
  Top 0.102: U1.A8 3.67,8 3.17,8.5 1.1,8.5 0.5,7.9 J25.1
  other vias: 0.5,7.5
~D26  (via drill 0.15)
  Bottom 0.102: J27.1 2.89,6.5 U1.B8
  other vias: 4.39,8
~D27  (via drill 0.15)
  Top 0.127: U1.B9 4.06,8.83 3.65,8.83 2.98,9.5 J19.1
  other vias: 2.5,9.5
~D28  (via drill 0.15)
  Top 0.102: U1.A9 3.46,8.5 3.19,8.77 2.76,8.77 2.17,9.36 2.17,9.39 v2.05,9.51
  Bottom 0.102: v2.05,9.51 2.04,9.5 J21.1
~D37  (via drill 0.15, 0.15 layers 1-2)
  GND 0.102: U1.H7 7.41,7.5 8.25,8.35 10.12,8.35 v10.65,7.82
  Bottom 0.102: J57.1 10.5,7.67 v10.65,7.82
  other vias: 7.39,7.5
~D39  (via drill 0.15)
  Top 0.127: U1.J8 8.3,8 8.7,8.4 9.7,8.4 J4.1
  other vias: 10,8.7
~D42  (via drill 0.15, 0.15 layers 1-2)
  GND 0.102: U1.H5 7.39,6.53 7.66,6.8 8.1,6.8 v8.4,6.5
  Bottom 0.102: v8.4,6.5 8.4,2.5 8.5,2.4 J53.1
  other vias: 7.39,6.5
~D43  (via drill 0.15)
  Bottom 0.102: U1.J5 7.89,5.79 7.91,5.77 7.91,3.13 8,3.04 J52.1
  other vias: 7.89,6.5
~D44  (via drill 0.15)
  Top 0.102: U1.J7 8.11,7.5 8.75,8.15 10.25,8.15 v10.5,8.4
  Bottom 0.102: v10.5,8.4 11,7.9 J58.1
~D45  (via drill 0.15)
  Bottom 0.102: U1.F5 5.8,5.92 5.8,2.64 5,1.83 J46.1
  other vias: 6.39,6.5

### Text on the board
Measures: 57-0.4x0.6 | 2-0.6x0.6 | All Dimension in Millimeters
Reference: 22 | 21 | 19 | 17 | 15 | 13 | 11 | 9 | 7 | 5 | 3 | 1 | 20 | 18 | 16 | 14 | 12 | 10 | 8 | 6 | 4 | 2 | 23 | 25 | 24 | 26 | 27 | 29 | 28 | 30 | 31 | 33 | 32 | 34 | 35 | 37 | 36 | 40 | 42 | 44 | 46 | 48 | 50 | 52 | 54 | 56 | 58 | 38 | 39 | 41 | 43 | 45 | 47 | 49 | 51 | 53 | 55 | 57 | 59
RF_Shield_Dimensions2: RF Shield: / H:1.2mm / Thickness: 0.2mm | Dimension: mm | Milled Slot for alignment leg | Alignment Leg Height: 1.8-1.9mm | Exposed Copper: 0.5mm
tDocu: This is a 4-layer board | 0.8mm Thick FR4 | N. Seidle